# EAGLE design nand_no_amp (EAGLE 7.2.0)
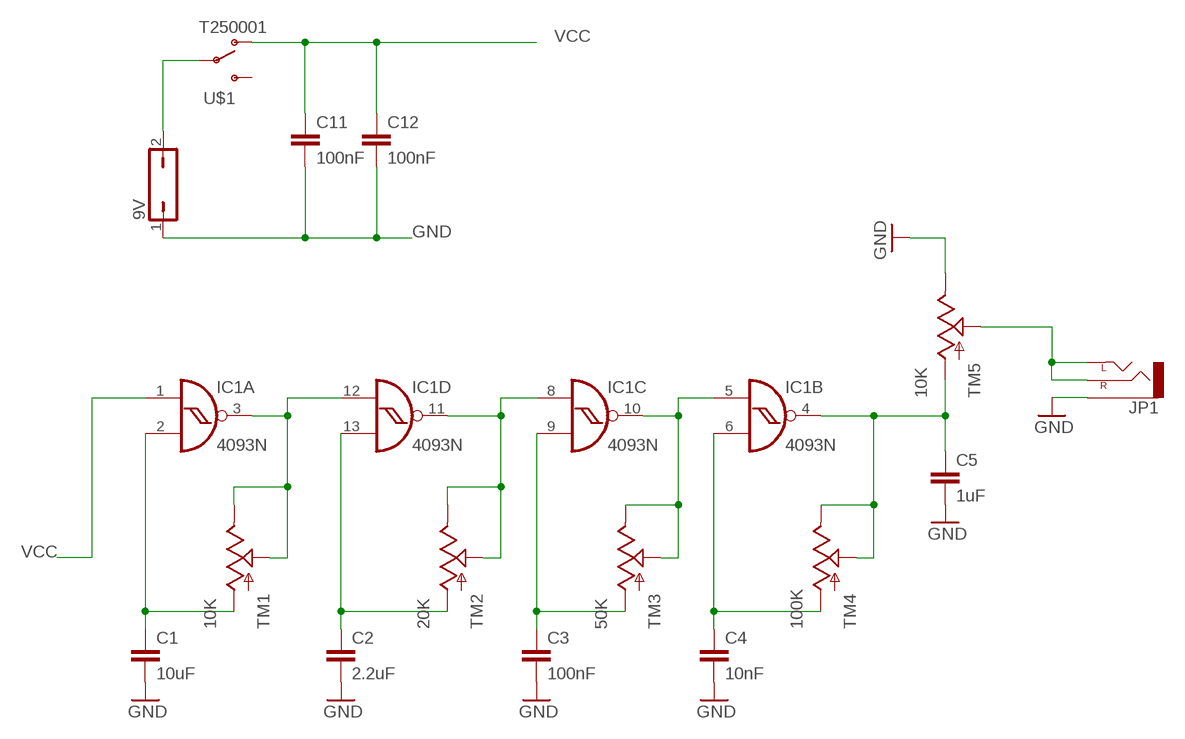
[diagram p0: schematic, sheet 1]

## Parts
9V  JP1Q  [JP1]
C1  10uF  CAPPTH1  [CAP-PTH-5MM]
C2  2.2uF  CAPPTH1  [CAP-PTH-5MM]
C3  100nF  CAPPTH1  [CAP-PTH-5MM]
C4  10nF  CAPPTH1  [CAP-PTH-5MM]
C5  1uF  CAPPTH1  [CAP-PTH-5MM]
C11  100nF  CAPPTH  [CAP-PTH-SMALL]
C12  100nF  CAPPTH  [CAP-PTH-SMALL]
IC1  4093N  [DIL14]
JP1  AUDIO-JACKPTH  [AUDIO-JACK]
TM1  10K  296SERIESPOT  [296SERIESPOT]
TM2  20K  296SERIESPOT  [296SERIESPOT]
TM3  50K  296SERIESPOT  [296SERIESPOT]
TM4  100K  296SERIESPOT  [296SERIESPOT]
TM5  10K  296SERIESPOT  [296SERIESPOT]
U$1  T250001  [T250001]

## Nets
AUDIO_OUT: JP1.RING(RIGHT) JP1.TIP(LEFT) TM5.PIN2(S)
GND: 9V.1 C1.2 C2.2 C3.2 C4.2 C5.2 C11.2 C12.2 JP1.SLEEVE TM5.PIN3(E)
N$3: IC1.3(A:O) IC1.12(D:I0) TM1.PIN2(S) TM1.PIN3(E)
N$4: IC1.8(C:I0) IC1.11(D:O) TM2.PIN2(S) TM2.PIN3(E)
N$5: IC1.5(B:I0) IC1.10(C:O) TM3.PIN2(S) TM3.PIN3(E)
N$6: C1.1 IC1.2(A:I1) TM1.PIN1(A)
N$7: C2.1 IC1.13(D:I1) TM2.PIN1(A)
N$8: C3.1 IC1.9(C:I1) TM3.PIN1(A)
N$9: C4.1 IC1.6(B:I1) TM4.PIN1(A)
N$12: C5.1 IC1.4(B:O) TM4.PIN2(S) TM4.PIN3(E) TM5.PIN1(A)
N$15: 9V.2 U$1.5(P)
VCC: C11.1 C12.1 IC1.1(A:I0) U$1.4(O)
Unconnected: U$1.6(S)

## Power pins joined to a net without a drawn wire
VCC: IC1.14(P:VDD)
VSS: IC1.7(P:VSS)

## Library data of the parts
9V = jumper:JP1Q: JUMPER
C1-C5 = SparkFun-Passives:CAP: Capacitor Standard 0603 ceramic capacitor, and 0.1" leaded capacitor.
C11 C12 = SparkFun-Capacitors:CAP: Capacitor Standard 0603 ceramic capacitor, and 0.1" leaded capacitor.
IC1 = 40xx:4093: Quad 2-input NAND schmitt trigger
JP1 = SparkFun-Connectors:AUDIO-JACK: 3.5mm Audio Jack Simple 3.5mm common PCB mount audio jack. Variant PTH is our storefront SKU PRT-08032
TM1-TM5 = 296seriesPOT:296SERIESPOT
U$1 = T250001:T250001

## Board
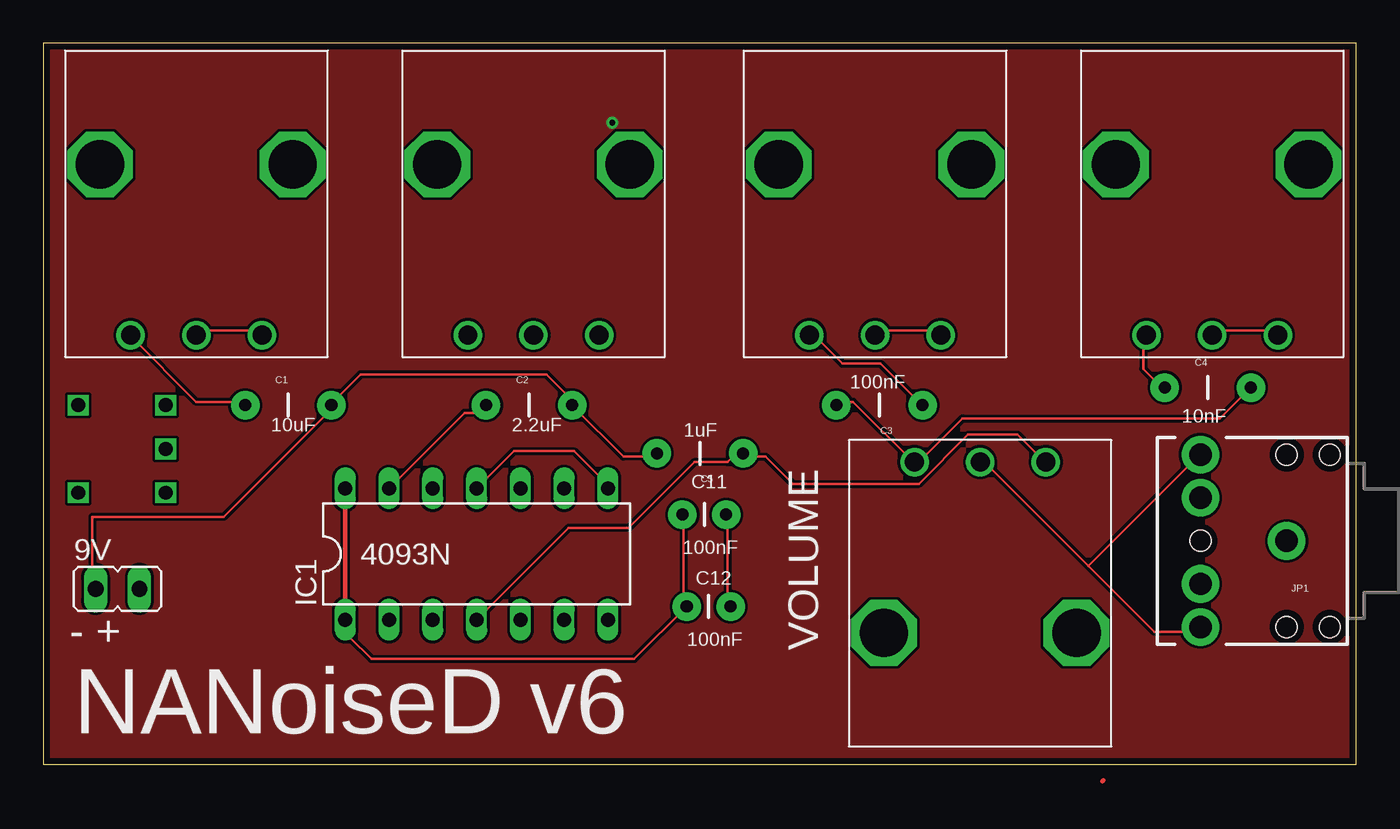
[diagram p1: board, top side]
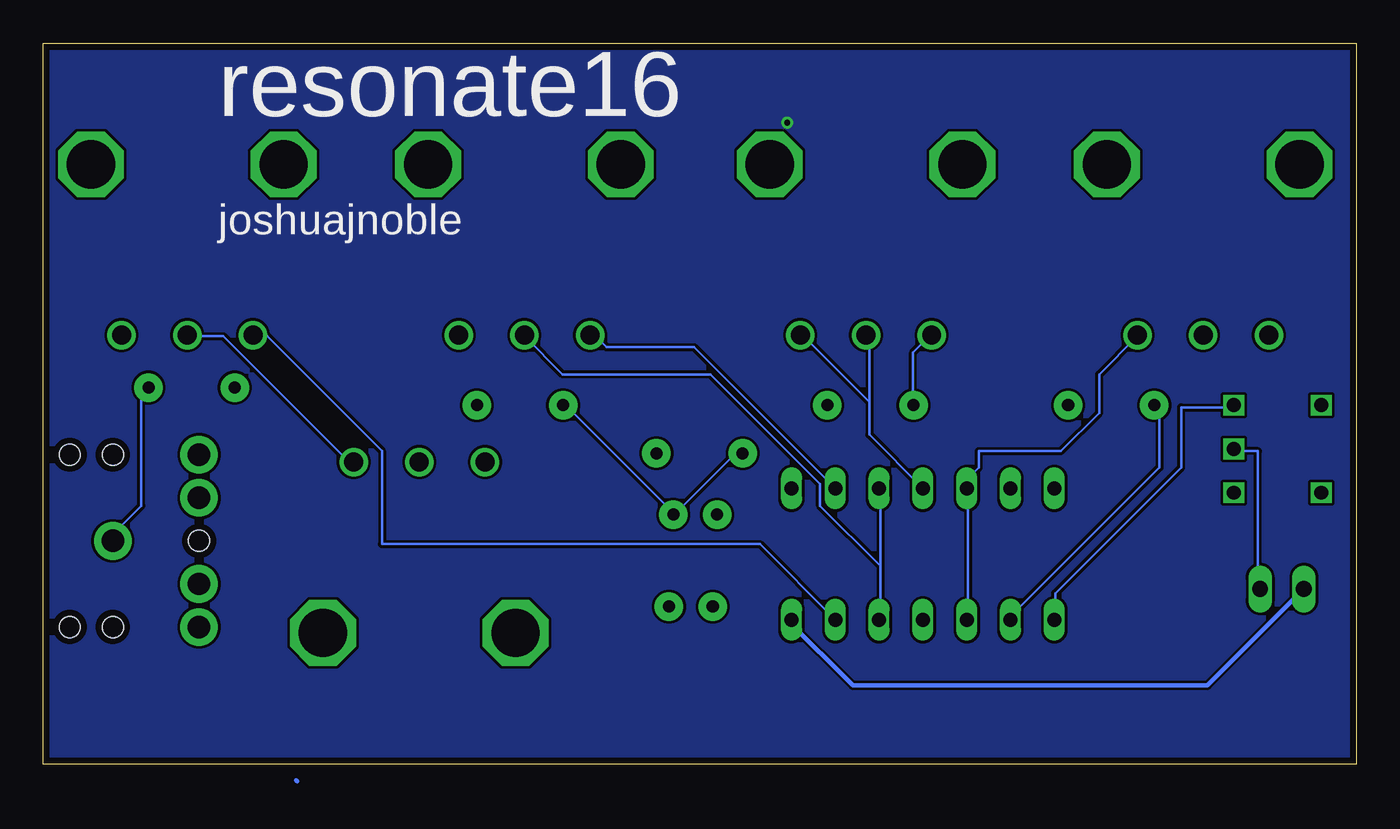
[diagram p2: board, bottom side, seen from below]

Size 76.18 x 41.83 mm. Coordinates in mm from the lower left corner, seen from the top.
Outline: 0,0 76.18,0 76.18,41.83 0,41.83 0,0
Copper layers (1*16): Top 0.0356mm / dielectric 1.5011mm / Bottom 0.0356mm
Design rules "LaenPCBOrder": minimum track width 6mil, minimum drill 13mil, track to track 6mil, track to pad 6mil, pad to pad 6mil, via to via 6mil, smd to smd 6mil, copper to edge 15mil, drill to drill 6mil, minimum pad ring 7mil, minimum via ring 7mil, stop-mask expansion 3mil, vias tented up to drill 0mil, thermal gap 10mil

### Footprints (pad centres in the part's own frame; a part is rotated, then mirrored left to right if it is on the bottom)
JP1 = drill 0.914 long: 1 0,-1.27; 2 0,1.27
CAP-PTH-5MM = drill 0.7 pad 1.651: 1 -2.5,0; 2 2.5,0
CAP-PTH-SMALL = drill 0.7 pad 1.651: 1 0,0; 2 2.54,0
DIL14 = drill 0.813 long: 1 -7.62,-3.81; 2 -5.08,-3.81; 3 -2.54,-3.81; 4 0,-3.81; 5 2.54,-3.81; 6 5.08,-3.81; 7 7.62,-3.81; 8 7.62,3.81; 9 5.08,3.81; 10 2.54,3.81; 11 0,3.81; 12 -2.54,3.81; 13 -5.08,3.81; 14 -7.62,3.81
AUDIO-JACK = drill 1.3 pad 2.184: RING 5,5; RSH 5,2.5; SLEEVE 0,0; TIP 5,-5; TSH 5,-2.5 | hole 1.2: 0,5; -2.5,5; -2.5,-5; 0,-5; 5,0
296SERIESPOT = drill 2.8 octagon: MOUNTL 9.906,-9.398; MOUNTR 9.906,1.778 | drill 1.1: PIN1 0,0; PIN2 0,-3.81; PIN3 0,-7.62
T250001 = drill 0.8 square: 4 5.08,0; 5 5.08,-2.54; 6 5.08,-5.08; P$1 0,0; P$2 0,-5.08

### Placement (x,y rotation side)
9V  4.32,10.16 270 top
C1  14.22,20.83 0 top
C2  28.19,20.83 0 top
C3  48.51,20.83 180 top
C4  67.56,21.84 0 top
C5  38.1,18.03 180 top
C11  37.08,14.48 0 top
C12  37.34,9.14 0 top
IC1  25.15,12.19 0 top
JP1  72.14,12.95 180 top
TM1  5.08,24.89 90 top
TM2  24.64,24.89 90 top
TM3  44.45,24.89 90 top
TM4  64.01,24.89 90 top
TM5  58.17,17.53 270 top
U$1  2.03,20.83 0 top

### Tracks (layer width: path | path; a pad name or v marks a point on that pad's centre or on a via)
AUDIO_OUT
  Top 0.152: 60.64,11.49 64.45,7.68 66.99,7.68 JP1.RING | 60.64,11.49 54.61,17.53 TM5.PIN2 | 60.64,11.49 66.99,17.84 JP1.TIP
GND
  Top 0.152: 9V.1 2.86,10.22 2.86,14.35 10.48,14.35 16.83,20.7 C1.2 16.83,21.02 18.41,22.61 29.21,22.61 30.8,21.02 C2.2 30.8,20.7 33.65,17.84 35.56,17.84 C5.2 | C3.2 46.04,21.02 46.99,21.02 50.48,17.53 TM5.PIN3 50.8,17.53 53.34,20.07 68.26,20.07 69.85,21.65 C4.2 | C12.2 39.69,9.27 39.69,14.35 C11.2
  Bottom 0.152: C4.2 70.17,21.65 70.49,21.34 70.49,14.99 72.07,13.4 72.07,13.08 JP1.SLEEVE | C5.2 35.88,18.16 39.37,14.67 C11.2 39.69,14.67 45.72,20.7 C3.2
  Bottom 0.254: 33.02,8.38 29.21,4.57 8.64,4.57 9V.1
N$1
  Top 0.254: 61.49,-0.94 61.45,-0.99
N$2
  Bottom 0.254: 61.49,-0.94 61.45,-0.99
N$3
  Top 0.152: TM1.PIN2 8.89,25.15 12.7,25.15 TM1.PIN3
  Bottom 0.152: IC1.3 22.54,8.64 22.54,15.94 IC1.12 22.54,16.26 22.54,16.57 21.91,17.21 21.91,18.16 17.15,18.16 14.92,20.38 14.92,22.61 12.7,24.83 TM1.PIN3
N$4
  Top 0.152: IC1.11 27.3,18.16 30.8,18.16 32.7,16.26 IC1.8
  Bottom 0.152: IC1.11 28.26,19.11 28.26,21.02 | 28.26,21.02 28.26,24.83 TM2.PIN2 | 28.26,21.02 32.07,24.83 TM2.PIN3
N$5
  Top 0.152: TM3.PIN2 48.26,25.15 52.07,25.15 TM3.PIN3
  Bottom 0.152: 27.62,11.49 27.62,15.94 IC1.10 | 27.62,11.49 27.62,8.64 IC1.5 | 27.62,11.49 31.12,14.99 31.12,16.26 37.46,22.61 46.04,22.61 48.26,24.83 TM3.PIN2
N$6
  Top 0.152: TM1.PIN1 5.08,24.83 8.89,21.02 11.43,21.02 C1.1
  Bottom 0.152: IC1.2 20,8.64 11.43,17.21 11.43,20.7 C1.1
N$7
  Top 0.152: IC1.13 24.45,20.38 25.08,20.38 25.4,20.7 C2.1
  Bottom 0.152: TM2.PIN1 24.77,24.83 25.72,23.88 25.72,21.02 C2.1
N$8
  Top 0.152: C3.1 50.8,21.02 48.58,23.24 46.35,23.24 44.77,24.83 44.45,24.83 TM3.PIN1
  Bottom 0.152: IC1.9 38.42,24.19 43.5,24.19 44.45,25.15 TM3.PIN1
N$9
  Top 0.152: C4.1 64.77,21.97 63.82,22.92 63.82,24.83 TM4.PIN1
  Bottom 0.152: IC1.6 34.61,12.76 56.52,12.76 56.52,18.16 63.18,24.83 63.82,24.83 TM4.PIN1
N$12
  Top 0.152: TM4.PIN3 71.44,25.15 67.94,25.15 TM4.PIN2 | IC1.4 30.48,13.72 33.97,13.72 37.78,17.53 39.69,17.53 40.01,17.84 40.32,17.84 C5.1 40.64,17.84 41.91,17.84 43.5,16.26 50.8,16.26 53.66,19.11 56.52,19.11 58.1,17.53 TM5.PIN1
  Bottom 0.152: TM5.PIN1 58.42,17.53 65.72,24.83 67.63,24.83 TM4.PIN2
N$15
  Bottom 0.152: U$1.5 6.98,18.16 5.72,18.16 5.72,10.22 9V.2
N$17  (via drill 0.33)
  other vias: 33.02,37.21
  pour Top: 0,41.91 76.2,41.66 76.45,0 0,0
  pour Bottom: -0.25,41.91 76.2,41.91 76.45,0.25 0,0
VCC
  Top 0.152: C11.1 37.15,14.35 37.15,9.27 C12.1 34.29,6.1 19.05,6.1 17.78,7.37 17.78,8.32 IC1.1
  Top 0.254: IC1.14 IC1.1
  Bottom 0.152: U$1.4 7.3,20.7 10.16,20.7 10.16,17.21 17.46,9.91 17.46,8.64 IC1.1

### Text on the board
tNames: - + | VOLUME | NANoiseD v6
bNames: resonate16 | joshuajnoble